# Altium schematic sheet ITAC.SchDoc
size A4
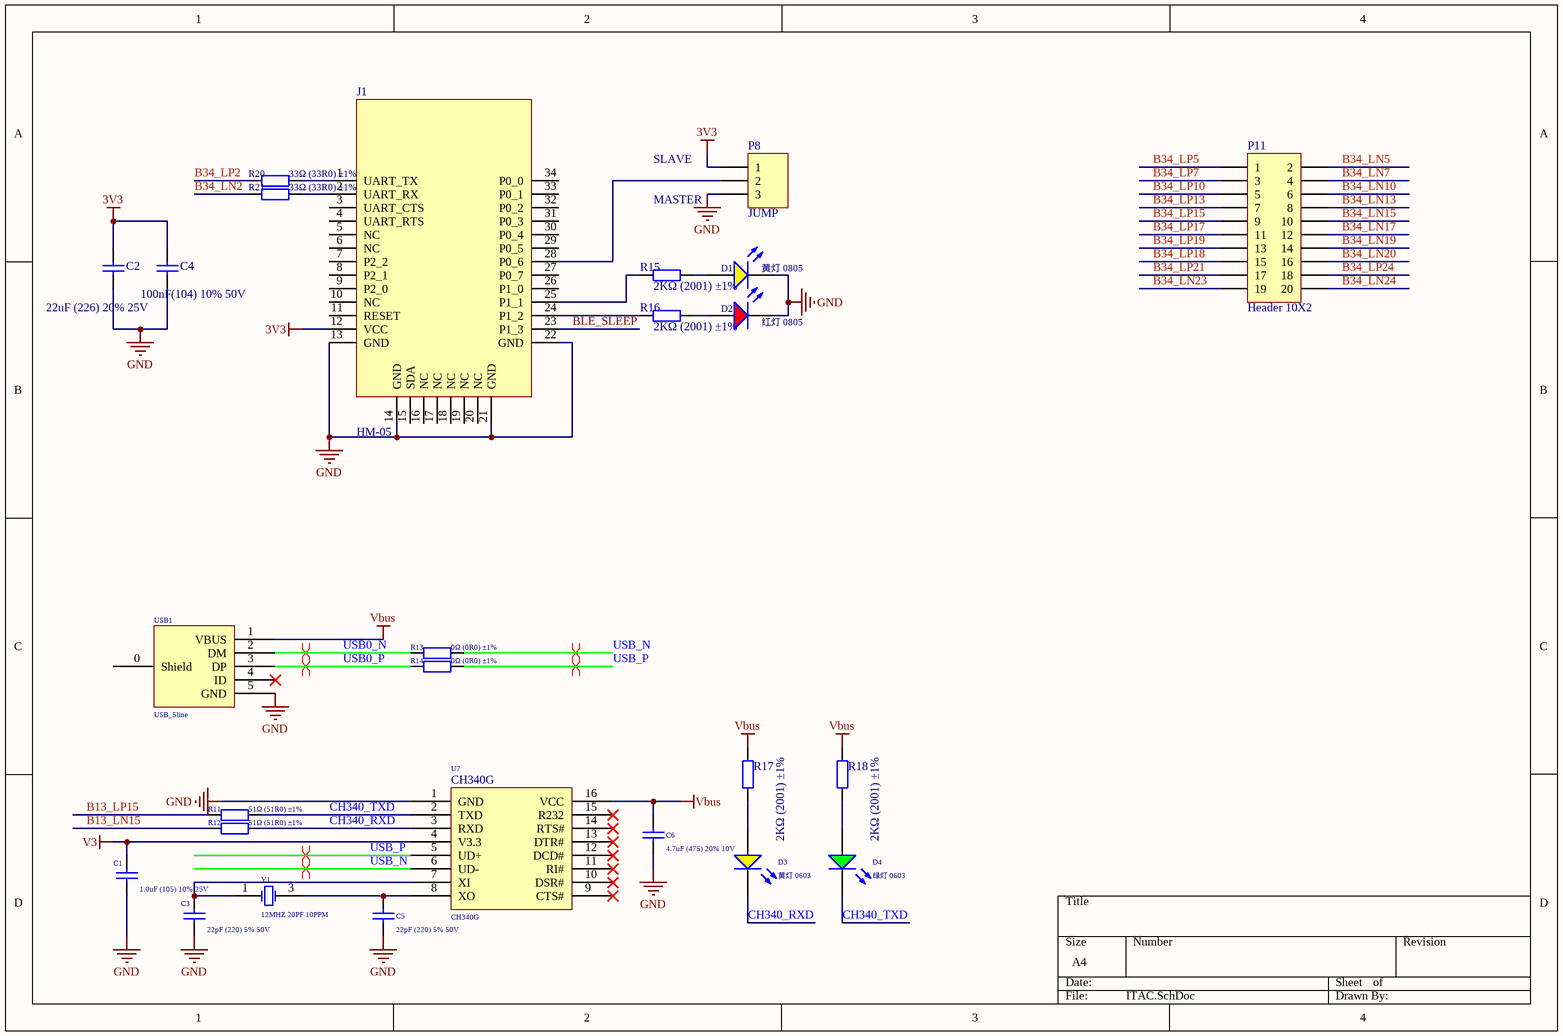
[diagram p0: ITAC.SchDoc]

## Parts
C1  1.0uF (105) 10% 25V  [0402_C]
C2  22uF (226) 20% 25V  [0805_C]
C3  22pF (220) 5% 50V  [0402_C]
C4  100nF(104) 10% 50V  [0805_C]
C5  22pF (220) 5% 50V  [0402_C]
C6  4.7uF (475) 20% 10V  [0402_C]
D1  黄灯 0805  [0805_LED_S1]
D2  红灯 0805  [0805_LED_S1]
D3  黄灯 0603  [0603_LED_S1]
D4  绿灯 0603  [0603_LED_S1]
J1  HM-05  [BT05]
P8  JUMP  [HDR1X3]
P11  Header 10X2  [HDR2X10]
R11  51Ω (51R0) ±1%  [0402_R]
R12  51Ω (51R0) ±1%  [0402_R]
R13  0Ω (0R0) ±1%  [0402_R]
R14  0Ω (0R0) ±1%  [0402_R]
R15  2KΩ (2001) ±1%  [0805_R]
R16  2KΩ (2001) ±1%  [0805_R]
R17  2KΩ (2001) ±1%  [0402_R]
R18  2KΩ (2001) ±1%  [0402_R]
R20  33Ω (33R0) ±1%  [0402_R]
R21  33Ω (33R0) ±1%  [0402_R]
U7  CH340G  [SOIC-16_150mil]
USB1  USB_5line  [USB-MICRO-5P-2F]
Y1  12MHZ 20PF 10PPM  [SMD-3225_4P]

## Nets
3V3: C2.2 C4.2 J1.12(VCC) P8.1
GND: C1.1 C2.1 C3.1 C4.1 C5.1 C6.1 D1.K D2.K J1.13(GND) J1.14(GND) J1.21(GND) J1.22(GND) P8.3 U7.1(GND) USB1.5(GND)
V3: C1.2 U7.4(V3.3)
Vbus: C6.2 R17.2 R18.1 U7.16(VCC) USB1.1(VBUS)
B13_LN15: R12.1
B13_LP15: R11.1
B34_LN2: R21.1
B34_LN5: P11.2
B34_LN7: P11.4
B34_LN10: P11.6
B34_LN13: P11.8
B34_LN15: P11.10
B34_LN17: P11.12
B34_LN19: P11.14
B34_LN20: P11.16
B34_LN23: P11.19
B34_LN24: P11.20
B34_LP2: R20.1
B34_LP5: P11.1
B34_LP7: P11.3
B34_LP10: P11.5
B34_LP13: P11.7
B34_LP15: P11.9
B34_LP17: P11.11
B34_LP18: P11.15
B34_LP19: P11.13
B34_LP21: P11.17
B34_LP24: P11.18
BLE_SLEEP: J1.23(P1_3)
CH340_RXD: D3.K R12.2 U7.3(RXD)
CH340_TXD: D4.K R11.2 U7.2(TXD)
USB0_N: R13.1 USB1.2(DM)
USB0_P: R14.1 USB1.3(DP)
USB_N: R13.2 U7.6(UD-)
USB_P: R14.2 U7.5(UD+)
NetC3_2: C3.2 U7.7(XI) Y1.1(OSC1)
NetC5_2: C5.2 U7.8(XO) Y1.3(OSC2)
NetD1_A: D1.A R15.2
NetD2_A: D2.A R16.2
NetD3_A: D3.A R17.1
NetD4_A: D4.A R18.2
NetJ1_1: J1.1(UART_TX) R20.2
NetJ1_2: J1.2(UART_RX) R21.2
NetJ1_24: J1.24(P1_2) R16.1
NetJ1_25: J1.25(P1_1) R15.1
NetJ1_28: J1.28(P0_6) P8.2

Not connected (* = marked no-connect by the designer): J1 3(UART_CTS) 4(UART_RTS) 5(NC) 6(NC) 7(P2_2) 8(P2_1) 9(P2_0) 10(NC) 11(RESET) 15(SDA) 16(NC) 17(NC) 18(NC) 19(NC) 20(NC) 26(P1_0) 27(P0_7) 29(P0_5) 30(P0_4) 31(P0_3) 32(P0_2) 33(P0_1) 34(P0_0); U7 9(CTS#)* 10(DSR#)* 11(RI#)* 12(DCD#)* 13(DTR#)* 14(RTS#)* 15(R232)*; USB1 0(Shield) 4(ID)*

## Layout directives
differential pair: USB0_N, USB0_P, USB_N, USB_P

## Notes on the sheet
- SLAVE
- MASTER

## Library data of the parts
C1 = 0402 1.0uF (105) 10% 25V: 贴片电容; ComponentLink1Description: 供应商链接; ComponentLink1URL: http://www.szlcsc.com/product/details_53938.html; Package: 0402; Supplier: LC; SuppliersPartNumber: C52923
C2 = 0805 22uF (226) 20% 25V: 贴片电容; ComponentLink1Description: 供应商链接; ComponentLink1URL: http://www.szlcsc.com/product/details_46786.html; Package: 0805; Supplier: LC; SuppliersPartNumber: C45783
C3 C5 = 0402 22pF (220) 5% 50V: 贴片电容; ComponentLink1Description: 供应商链接; ComponentLink1URL: http://www.szlcsc.com/product/details_1907.html; Package: 0402; Supplier: LC; SuppliersPartNumber: C1555
C4 = 0805 100nF(104) 10% 50V: 贴片电容; ComponentLink1Description: 供应商链接; ComponentLink1URL: http://www.szlcsc.com/product/details_50686.html; Package: 0805; Supplier: LC; SuppliersPartNumber: C49678
C6 = 0402 4.7uF (475) 20% 10V: 贴片电容; ComponentLink1Description: 供应商链接; ComponentLink1URL: http://www.szlcsc.com/product/details_24469.html; Package: 0402; Supplier: LC; SuppliersPartNumber: C23733
D1 = 0805 黄灯: 发光二极管; ComponentLink1Description: 供应商链接; ComponentLink1URL: http://www.szlcsc.com/product/details_2669.html; Package: 0805; Supplier: LC; SuppliersPartNumber: C2296
D2 = 0805 红灯: 发光二极管; ComponentLink1Description: 供应商链接; ComponentLink1URL: http://www.szlcsc.com/product/details_2668.html; Package: 0805; Supplier: LC; SuppliersPartNumber: C2295
D3 = 0603 黄灯: 发光二极管; ComponentLink1Description: 供应商链接; ComponentLink1URL: http://www.szlcsc.com/product/details_73147.html; Package: 0603; Supplier: LC; SuppliersPartNumber: C72038
D4 = 0603 绿灯: 发光二极管; ComponentLink1Description: 供应商链接; ComponentLink1URL: http://www.szlcsc.com/product/details_73152.html; Package: 0603; Supplier: LC; SuppliersPartNumber: C72043
P8 = Header 3: Header, 3-Pin; LatestRevisionDate: 17-Jul-2002; LatestRevisionNote: Re-released for DXP Platform.; Publisher: Altium Limited
P11 = Header 10X2: Header, 10-Pin, Dual row; LatestRevisionDate: 17-Jul-2002; LatestRevisionNote: Re-released for DXP Platform.; Publisher: Altium Limited
R11 R12 = 0402 51Ω (51R0) 1%: 贴片电阻; ComponentLink1Description: 供应商链接; ComponentLink1URL: http://www.szlcsc.com/product/details_25868.html; Package: 0402; Supplier: LC; SuppliersPartNumber: C25125
R13 R14 = 0402 0Ω (0R0) 1%: 贴片电阻; ComponentLink1Description: 供应商链接; ComponentLink1URL: http://www.szlcsc.com/product/details_17853.html; Package: 0402; Supplier: LC; SuppliersPartNumber: C17168
R15 R16 = 0805 2KΩ (2001) 1%: 贴片电阻; ComponentLink1Description: 供应商链接; ComponentLink1URL: http://www.szlcsc.com/product/details_18292.html; Package: 0805; Supplier: LC; SuppliersPartNumber: C17604
R17 R18 = 0402 2KΩ (2001) 1%: 贴片电阻; ComponentLink1Description: 供应商链接; ComponentLink1URL: http://www.szlcsc.com/product/details_4516.html; Package: 0402; Supplier: LC; SuppliersPartNumber: C4109
R20 R21 = 0402 33Ω (33R0) 1%: 贴片电阻; ComponentLink1Description: 供应商链接; ComponentLink1URL: http://www.szlcsc.com/product/details_25848.html; Package: 0402; Supplier: LC; SuppliersPartNumber: C25105
U7 = CH340G_[C14267]: USB; ComponentLink1Description: 供应商链接; ComponentLink1URL: http://www.szlcsc.com/product/details_14927.html; Package: SOIC-16_150mil; Supplier: LC; SuppliersPartNumber: C14267
Y1 = SMD-3225_4P  12MHZ 20PF 10PPM: 贴片晶振; ComponentLink1Description: 供应商链接; ComponentLink1URL: http://www.szlcsc.com/product/details_9522.html; Package: SMD-3225_4P; Supplier: LC; SuppliersPartNumber: C9002